# EAGLE design SUperUnioc_analog_ServosExtension (EAGLE 6.5.0)
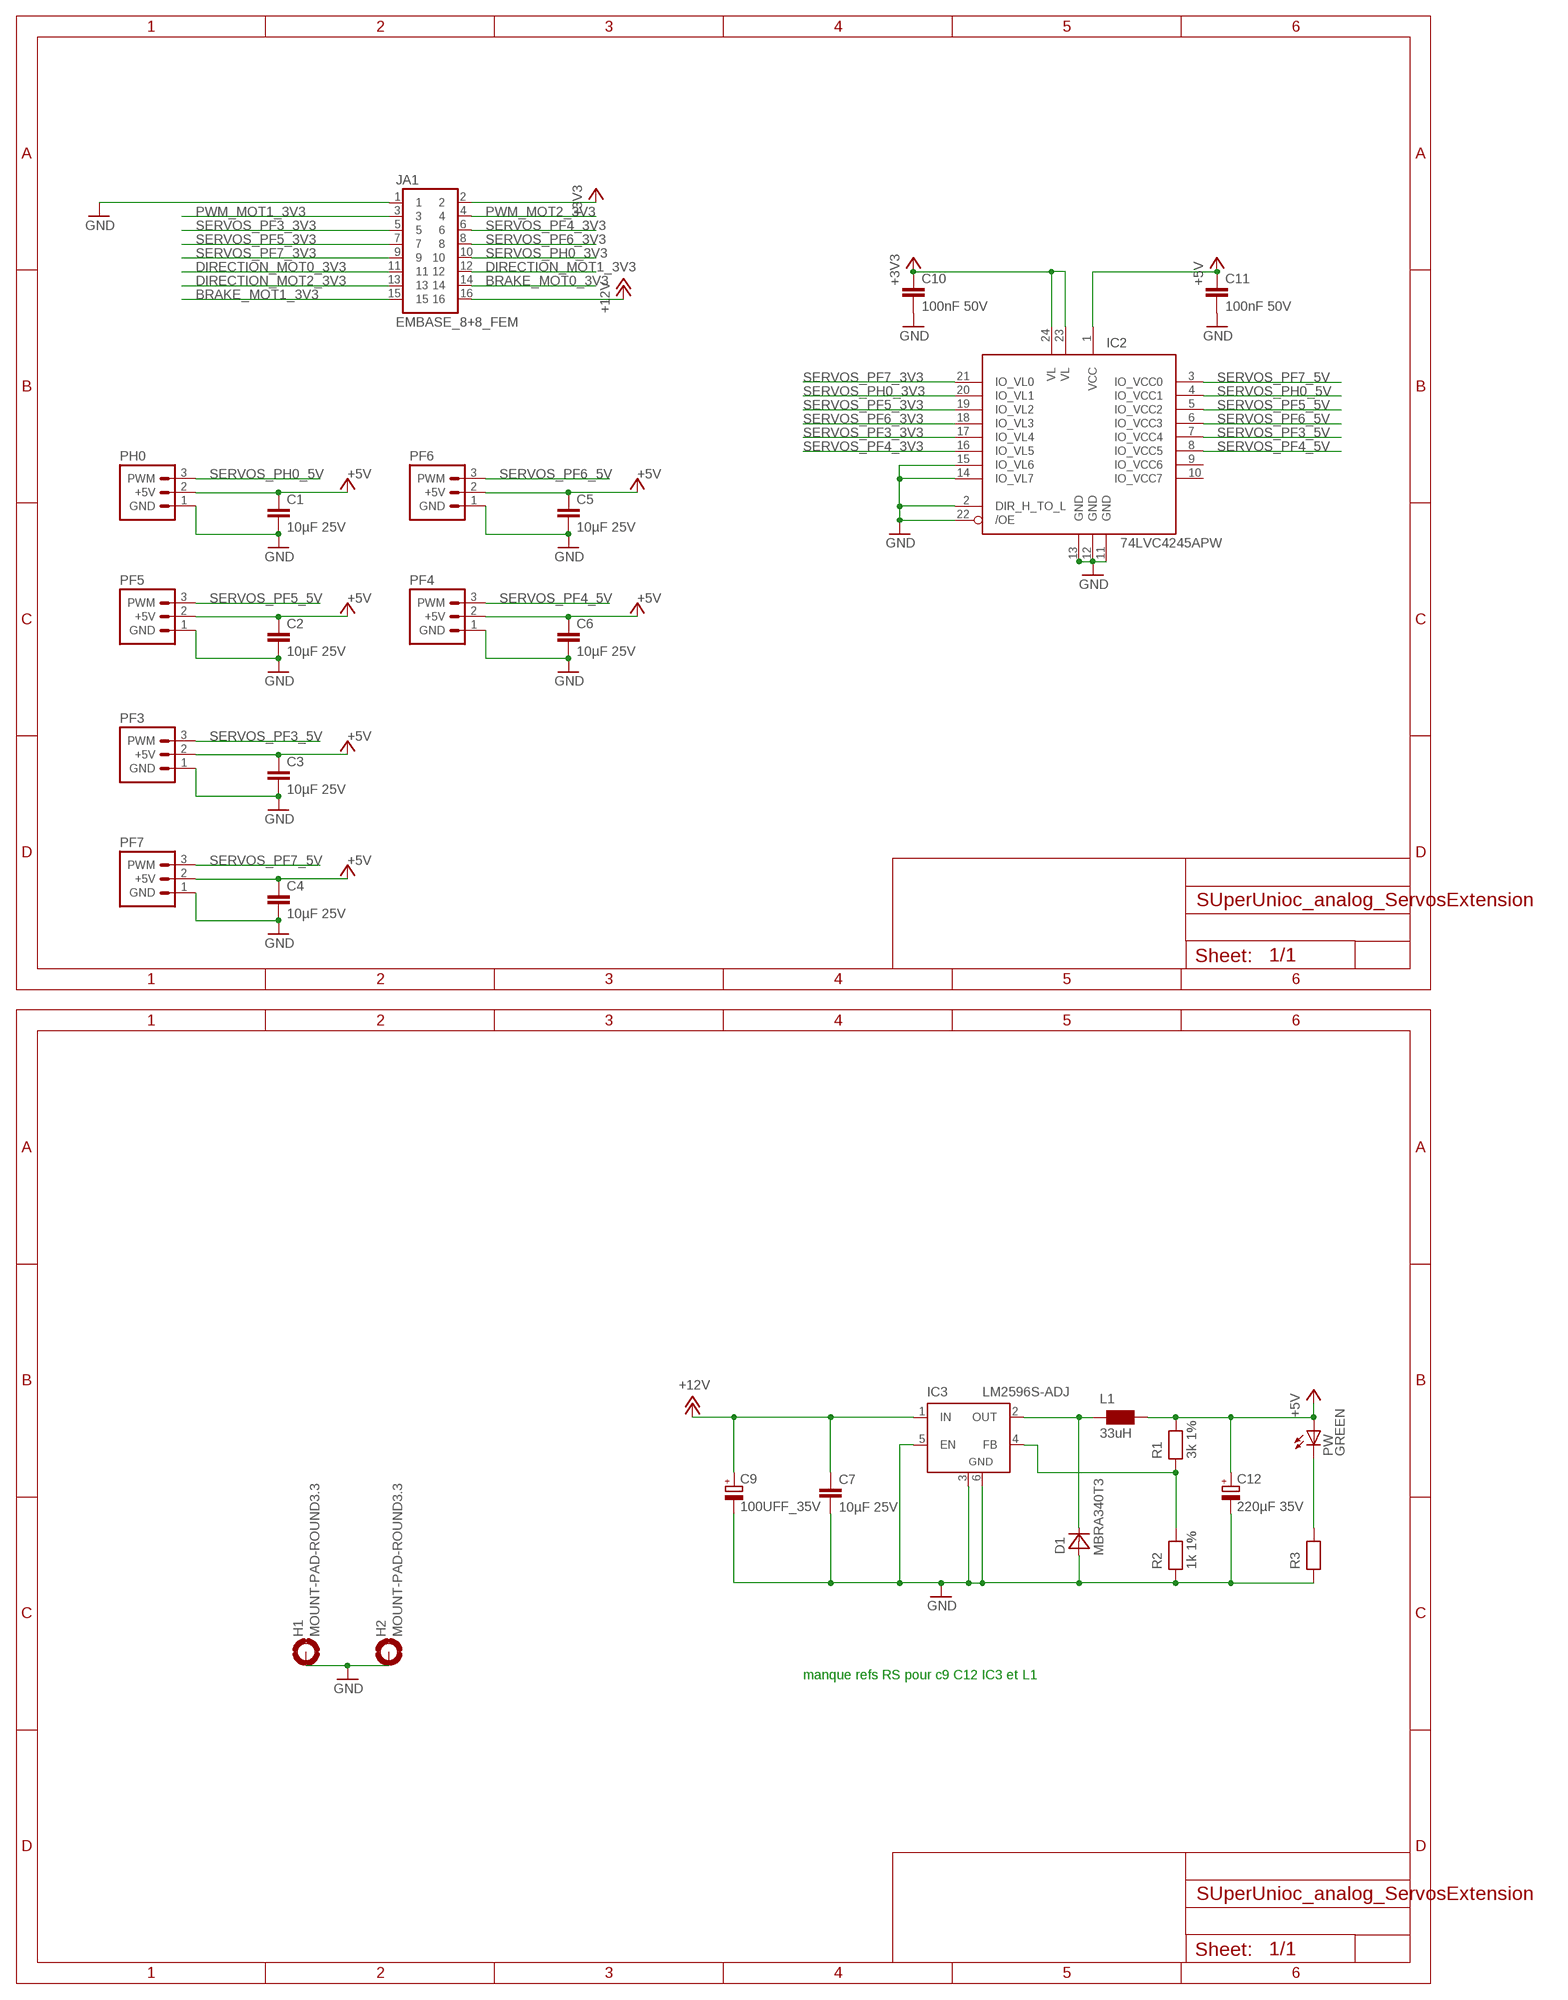
[diagram p0: schematic, sheet 1]

## Parts
C1  10µF 25V  10UF-C_25V  [C1210]
C2  10µF 25V  10UF-C_25V  [C1210]
C3  10µF 25V  10UF-C_25V  [C1210]
C4  10µF 25V  10UF-C_25V  [C1210]
C5  10µF 25V  10UF-C_25V  [C1210]
C6  10µF 25V  10UF-C_25V  [C1210]
C7  10µF 25V  10UF-C_25V  [C1210]
C9  100UFF_35V  [PANASONIC_F]
C10  100nF 50V  100NF-F  [C0603]
C11  100nF 50V  100NF-F  [C0603]
C12  220µF 35V  220UFF_35V  [PANASONIC_F]
D1  MBRA340T3  [SMA]
H1  MOUNT-PAD-ROUND3.3  [3,3-PAD]
H2  MOUNT-PAD-ROUND3.3  [3,3-PAD]
IC2  74LVC4245APW  [TSSOP24]
IC3  LM2596S-ADJ  [TO263-5]
JA1  EMBASE_8+8_FEM  [EMBASE_8+8_FEM]
L1  33uH  33µH-3.3A  [SRR1280]
PF3  ANALOG_SERVO  [ANALOG_SERVOS]
PF4  ANALOG_SERVO  [ANALOG_SERVOS]
PF5  ANALOG_SERVO  [ANALOG_SERVOS]
PF6  ANALOG_SERVO  [ANALOG_SERVOS]
PF7  ANALOG_SERVO  [ANALOG_SERVOS]
PH0  ANALOG_SERVO  [ANALOG_SERVOS]
PW  GREEN  LED_G  [CHIP-LED0805]
R1  3k 1%  3K09-F  [R0603]
R2  1k 1%  1K-F  [R0603]
R3  470-F  [R0603]

## Nets
+3V3: C10.1 IC2.23(VL) IC2.24(VL) JA1.2
+5V: C1.1 C2.1 C3.1 C4.1 C5.1 C6.1 C11.1 C12.+ IC2.1(VCC) L1.2 PF3.2(+5V) PF4.2(+5V) PF5.2(+5V) PF6.2(+5V) PF7.2(+5V) PH0.2(+5V) PW.A R1.2
+12V: C7.1 C9.+ IC3.1(IN) JA1.16
BRAKE_MOT0_3V3: JA1.14
BRAKE_MOT1_3V3: JA1.15
DIRECTION_MOT0_3V3: JA1.11
DIRECTION_MOT1_3V3: JA1.12
DIRECTION_MOT2_3V3: JA1.13
GND: C1.2 C2.2 C3.2 C4.2 C5.2 C6.2 C7.2 C9.- C10.2 C11.2 C12.- D1.A H1.B3,3(MOUNT) H2.B3,3(MOUNT) IC2.2(DIR_H_TO_L) IC2.11(GND) IC2.12(GND) IC2.13(GND) IC2.14(IO_VL7) IC2.15(IO_VL6) IC2.22(/OE) IC3.3(GND) IC3.5(EN) IC3.6(GND) JA1.1 PF3.1(GND) PF4.1(GND) PF5.1(GND) PF6.1(GND) PF7.1(GND) PH0.1(GND) R2.1 R3.1
N$1: PW.C R3.2
N$3: IC3.4(FB) R1.1 R2.2
N$17: D1.C IC3.2(OUT) L1.1
PWM_MOT1_3V3: JA1.3
PWM_MOT2_3V3: JA1.4
SERVOS_PF3_3V3: IC2.17(IO_VL4) JA1.5
SERVOS_PF3_5V: IC2.7(IO_VCC4) PF3.3(PWM)
SERVOS_PF4_3V3: IC2.16(IO_VL5) JA1.6
SERVOS_PF4_5V: IC2.8(IO_VCC5) PF4.3(PWM)
SERVOS_PF5_3V3: IC2.19(IO_VL2) JA1.7
SERVOS_PF5_5V: IC2.5(IO_VCC2) PF5.3(PWM)
SERVOS_PF6_3V3: IC2.18(IO_VL3) JA1.8
SERVOS_PF6_5V: IC2.6(IO_VCC3) PF6.3(PWM)
SERVOS_PF7_3V3: IC2.21(IO_VL0) JA1.9
SERVOS_PF7_5V: IC2.3(IO_VCC0) PF7.3(PWM)
SERVOS_PH0_3V3: IC2.20(IO_VL1) JA1.10
SERVOS_PH0_5V: IC2.4(IO_VCC1) PH0.3(PWM)
Unconnected: IC2.9(IO_VCC6) IC2.10(IO_VCC7)

## Notes on the sheet
- manque refs RS pour c9 C12 IC3 et L1

## Library data of the parts
C1-C7 = robotter_capacitor:10UF; MOUSER: 963-TMK316BJ106KL-T; RS: 766-1185
C9 = robotter_capacitor:100UF; MOUSER: 667-EEE-FK1V101P; RS: 537-0613; VALUE: 100µF 35V
C10 C11 = robotter_capacitor:100NF; MOUSER: 81-GRM188F51H104ZA01; RS: 723-5534
C12 = robotter_capacitor:220UF; MOUSER: 667-EEE-FP1V221AP; RS: 568-828
D1 = robotter_diode:MBRA340T3: Surface Mount Schottky Power Rectifier Source: http://www.onsemi.com/pub_link/Collateral/MBRA340T3-D.PDF; MOUSER: 863-MBRA340T3G; RS: 688-0502
H1 H2 = holes:MOUNT-PAD-ROUND: MOUNTING PAD, round
IC2 = robotter_ic:74LVC4245: octal transceiver buffer; MOUSER: 771-74LVC4245APW-T; RS: 380-0500
IC3 = robotter_ic:LM2596S: STEP-DOWN VOLTAGE REGULATOR; FARNELL: 1469194; MOUSER: 926-LM2596SX-ADJNOPB; RS: 533-3715
JA1 = robotter_connector:EMBASE_8+8_FEM; FARNELL: 1109794; MOUSER: 855-M22-7140842; RS: 605-8847
L1 = robotter_inductor:33µH; MOUSER: 652-SRR1280-330M; RS: 727-2274; VALUE: 33µH
PF3-PF7 PH0 = robotter_connector:ANALOG_SERVO: PIN HEADER; OC_FARNELL: unknown; OC_NEWARK: unknown
PW = robotter_diode:LED_; MOUSER: 859-LTST-C171GKT; RS: 692-0935
R1 = robotter_resistor:3K09; MOUSER: 667-ERA-3AEB3091V; RS: 708-7574
R2 = robotter_resistor:1K; MOUSER: 71-CRCW0603-1.0K-E3; RS: 213-2266; VALUE: 1k
R3 = robotter_resistor:470; MOUSER: 279-CRG0603F470R; RS: 213-2222

## Board
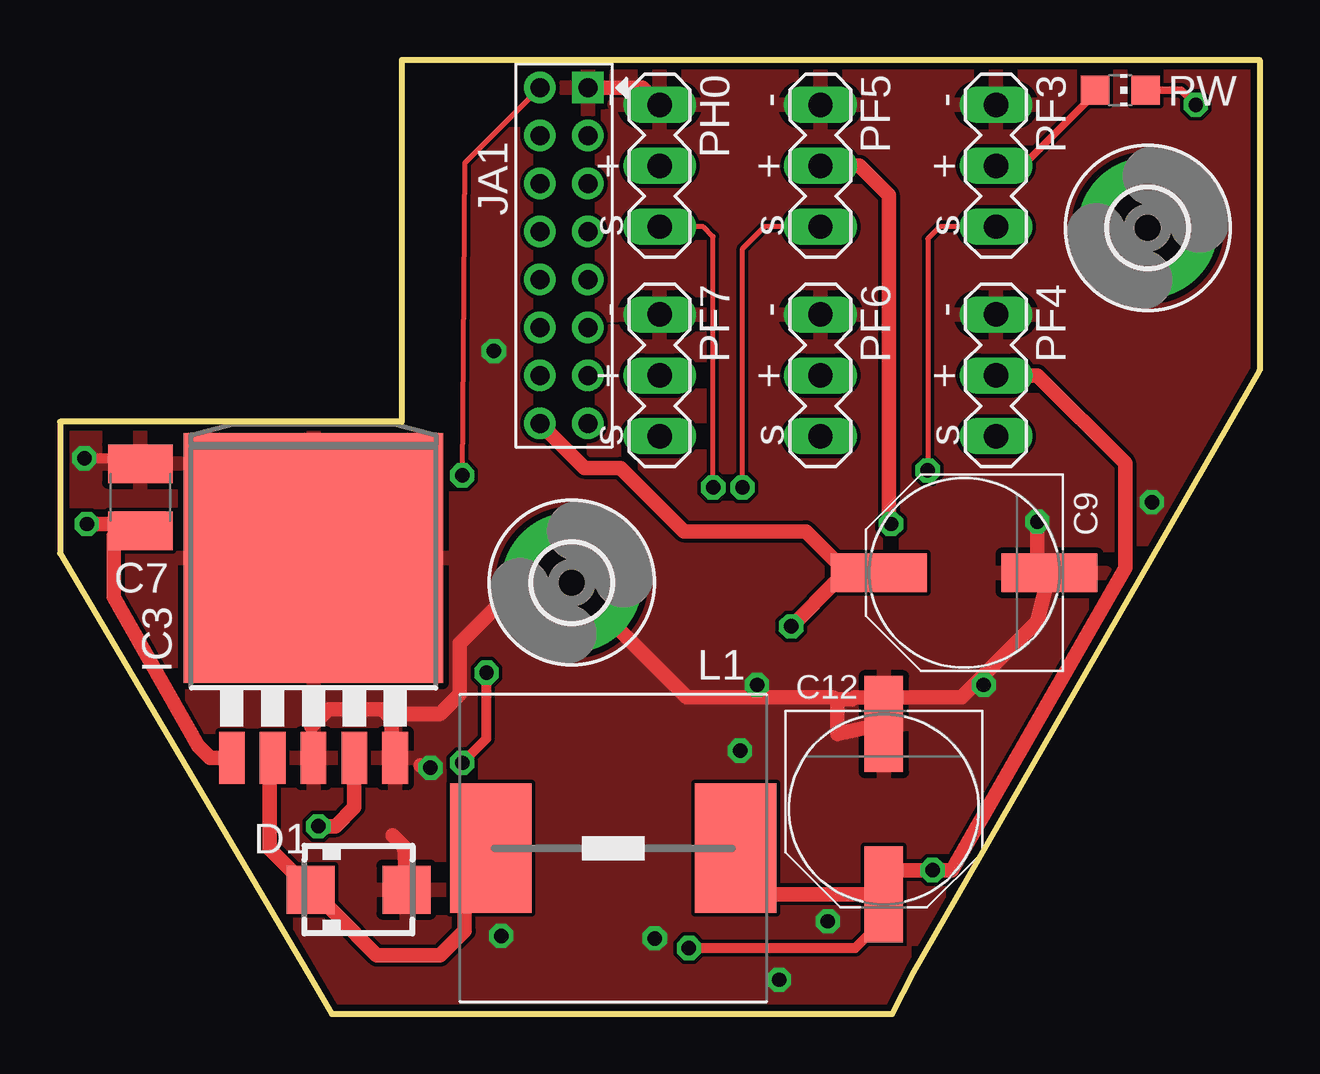
[diagram p1: board, top side]
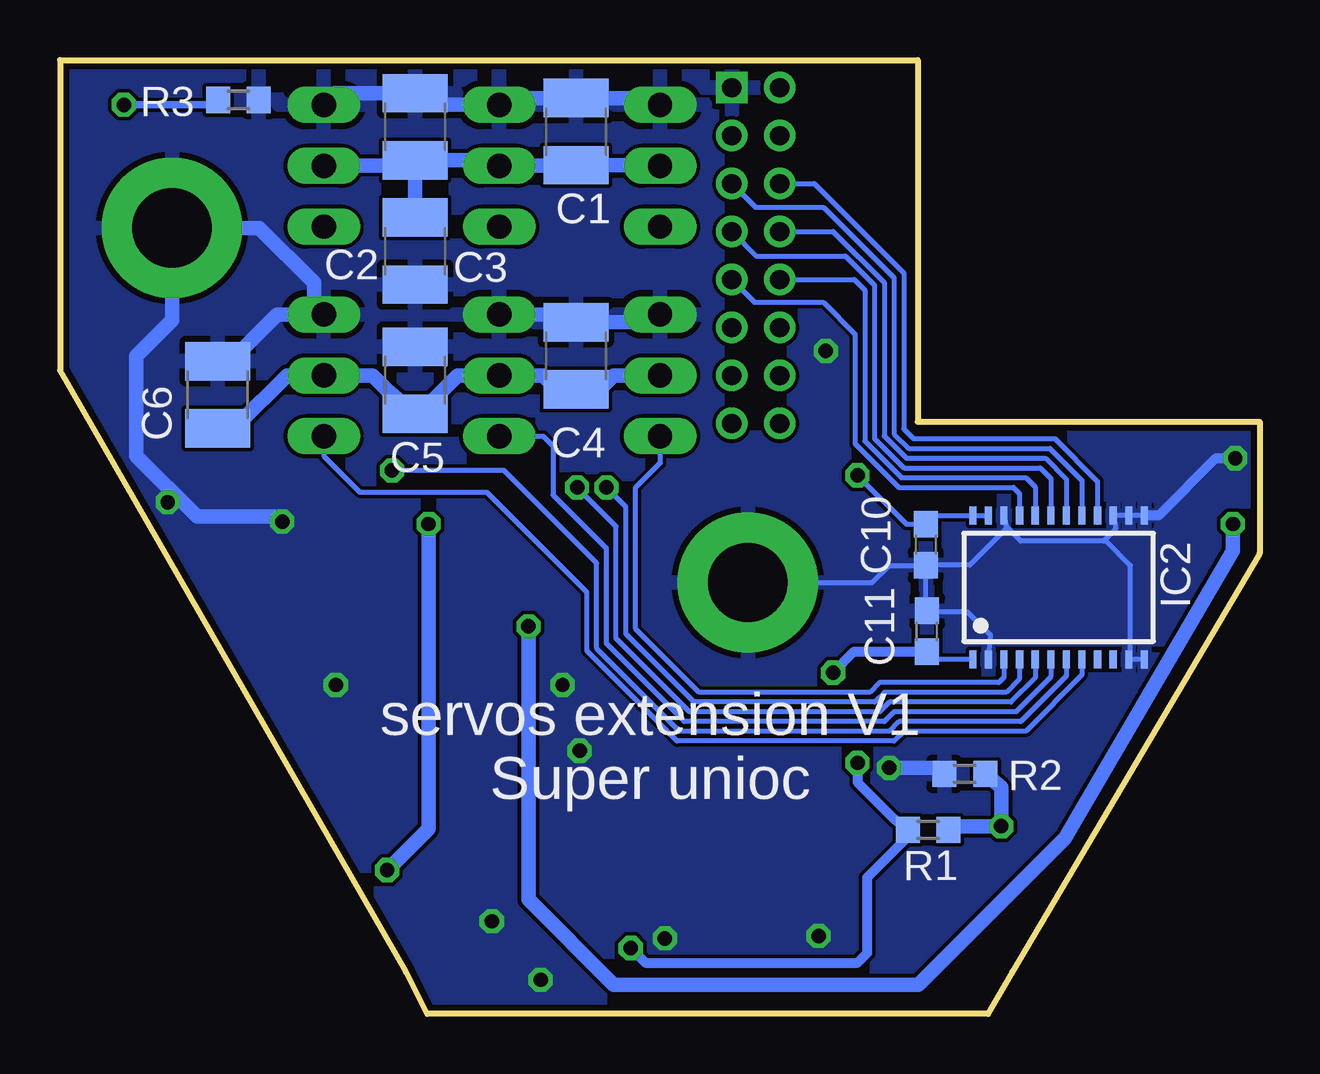
[diagram p2: board, bottom side, seen from below]

Size 50.01 x 39.77 mm. Coordinates in mm from the lower left corner, seen from the top.
Outline: 0.01,19.2 0.01,24.69 14.25,24.69 14.25,39.77 50.01,39.77 50.01,26.82 35.59,1.75 34.7,0 11.33,0 10.31,1.75 0,19.2
Copper layers (1*16): Top 0.035mm / dielectric 1.5mm / Bottom 0.035mm
Design rules "default *": minimum track width 6mil, minimum drill 6mil, track to track 6mil, track to pad 6mil, pad to pad 6mil, via to via 6mil, smd to smd 6mil, copper to edge 10mil, drill to drill 8mil, minimum pad ring 10mil, minimum via ring 8mil, stop-mask expansion 4mil, vias tented up to drill 0mil, thermal gap 10mil

### Footprints (pad centres in the part's own frame; a part is rotated, then mirrored left to right if it is on the bottom)
C1210 = smd 1.6 x 2.7: 1 -1.4,0; 2 1.4,0
PANASONIC_F = smd 4 x 1.6: + 3.55,0; - -3.55,0
C0603 = smd 1.1 x 1: 1 -0.85,0; 2 0.85,0
SMA = smd 2 x 2: A 2,0; C -2,0
3,3-PAD = drill 3.3 pad 5.842: B3,3 0,0
TSSOP24 = smd 0.3 x 0.75: 1 -3.575,-3; 2 -2.925,-3; 3 -2.275,-3; 4 -1.625,-3; 5 -0.975,-3; 6 -0.325,-3; 7 0.325,-3; 8 0.975,-3; 9 1.625,-3; 10 2.275,-3; 11 2.925,-3; 12 3.575,-3; 13 3.575,3; 14 2.925,3; 15 2.275,3; 16 1.625,3; 17 0.975,3; 18 0.325,3; 19 -0.325,3; 20 -0.975,3; 21 -1.625,3; 22 -2.275,3; 23 -2.925,3; 24 -3.575,3
TO263-5 = smd 1.067 x 2.159: 1 -3.404,-5.791; 2 -1.702,-5.791; 3 0,-5.791; 4 1.702,-5.791; 5 3.404,-5.791 | smd 10.8 x 10.41: 6 0,2.54
EMBASE_8+8_FEM = drill 0.8 pad 1.27 square: 1 -7,1 | drill 0.8 pad 1.27: 2 -7,-1; 3 -5,1; 4 -5,-1; 5 -3,1; 6 -3,-1; 7 -1,1; 8 -1,-1; 9 1,1; 10 1,-1; 11 3,1; 12 3,-1; 13 5,1; 14 5,-1; 15 7,1; 16 7,-1
SRR1280 = smd 3.4 x 5.4: 1 -5.1,0; 2 5.1,0
ANALOG_SERVOS = drill 1.016 long: 1 -2.54,0; 2 0,0; 3 2.54,0
CHIP-LED0805 = smd 1.2 x 1.2: A 0,-1.05; C 0,1.05
R0603 = smd 1 x 1.1: 1 -0.85,0; 2 0.85,0

### Placement (x,y rotation side)
C1  28.5,36.78 90 bottom
C2  35.2,36.98 90 bottom
C3  35.2,31.8 270 bottom
C4  28.5,27.43 90 bottom
C5  35.2,26.42 90 bottom
C6  43.43,25.81 90 bottom
C7  3.35,21.54 90 top
C9  37.69,18.39 180 top
C10  13.92,19.56 270 bottom
C11  13.87,15.95 90 bottom
C12  34.34,8.53 270 top
D1  12.45,5.18 0 top
H1  45.34,32.77 0 top
H2  21.34,17.98 0 top
IC2  8.38,17.78 0 bottom
IC3  10.57,16.46 0 top
JA1  21.01,31.61 270 top
L1  23.06,6.91 0 top
PF3  39.01,35.36 270 top
PF4  39.01,26.62 270 top
PF5  31.7,35.36 270 top
PF6  31.7,26.62 270 top
PF7  24.99,26.62 270 top
PH0  24.99,35.36 270 top
PW  44.2,38.51 270 top
R1  13.82,7.67 180 bottom
R2  12.29,10.01 0 bottom
R3  42.57,38.1 180 bottom

### Tracks (layer width: path | path; a pad name or v marks a point on that pad's centre or on a via)
+3V3  (via drill 0.6)
  Top 0.203: JA1.2 16.87,35.47 v16.76,22.45
  Bottom 0.203: v16.76,22.45 14.73,20.42 14.43,20.42 | 14.43,20.42 14.33,20.42 | IC2.23 IC2.24 13.55,20.78 C10.1 14.41,20.41 14.43,20.42
+5V  (via drill 0.6)
  Top 0.305: PW.A 43.15,38.37 40.13,35.36 PF3.2
  Top 0.406: v16.76,10.46 17.78,11.48 v17.78,14.22 | 34.46,5.99 34.34,4.47 34.34,3.95 33.14,2.74 v26.21,2.74
  Top 0.61: PF5.2 33.32,35.36 34.54,34.14 34.54,20.52 v34.65,20.42 | PF4.2 40.74,26.62 44.4,22.96 44.4,18.59 37.19,5.99 v36.37,5.99 34.46,5.99 C12.+ 28.95,4.98 28.24,5.69 28.24,6.83 L1.2
  Bottom 0.203: IC2.1 13.55,14.78 C11.1
  Bottom 0.406: v17.78,14.22 16.9,15.1 C11.1 | v26.21,2.74 25.6,2.13 16.76,2.13 16.36,2.54 16.36,5.69 14.68,7.37 R1.2 15.22,8.13 15.24,8.13 16.76,9.65 v16.76,10.46
  Bottom 0.61: PH0.2 25.02,35.38 C1.1 28.52,35.36 PF5.2 31.92,35.58 C2.1 | C2.1 35.43,35.36 PF3.2 | PF7.2 26.92,26.62 27.51,26.03 C4.1 28.68,26.21 29.46,26.21 29.87,26.62 PF6.2 33.43,26.62 35.03,25.02 C5.1 36.4,26.03 36.98,26.62 PF4.2 40.54,26.62 42.57,24.59 43.25,24.59 C6.1 | v34.65,20.42 34.65,7.72 v36.37,5.99 | C3.1 C2.1
+12V  (via drill 0.6)
  Top 0.61: JA1.16 21.86,22.76 23.37,22.76 26.01,20.12 31.09,20.12 32.72,18.49 | C9.+ 33.53,18.49 32.72,18.49 | 32.72,18.49 32.41,18.08 | 32.41,18.08 v30.48,16.15 | 32.72,18.49 32.51,18.49 32.41,18.08 | v1.12,20.42 2.16,20.42 C7.1 2.24,19.94 2.24,17.37 5.75,11.17 6.26,10.67 IC3.1
  Bottom 0.61: v1.12,20.42 1.12,19.3 8.13,7.32 14.22,1.22 26.92,1.22 30.48,4.78 v30.48,16.15
GND  (via drill 0.6)
  Top 0.406: v1.02,23.16 2.21,23.16 C7.2
  Top 0.61: 10.46,11.99 11.18,12.7 13.41,12.7 13.61,12.5 | 13.61,12.5 13.82,12.29 13.82,10.41 | JA1.1 24.28,38.61 PH0.1 | PF3.1 40.21,37.9 | 13.61,12.5 15.85,12.5 16.66,13.31 16.66,15.44 19.2,17.98 H2.B3,3 26.13,13.19 32.22,13.19 32.41,13 | 13.87,7.45 14.34,6.97 D1.A | v15.44,10.26 15.04,10.36 | v40.74,20.52 40.74,18.4 C9.- 40.74,16.35 37.57,13.19 33.1,13.19 33.02,13.11 32.51,13.11 32.41,13 | 32.41,13 32.41,11.68 C12.-
  Bottom 0.203: IC2.13 IC2.14 IC2.15 6.01,20.21 6.5,19.71 | 6.5,19.71 9.96,19.71 10.56,20.31 IC2.22 10.56,20.23 12.08,18.71 C10.2 | C10.2 13.92,16.85 C11.2 13.83,16.76 12.19,16.76 11.21,15.78 IC2.2 | IC2.12 IC2.11 5.38,14.81 5.38,18.69 6.4,19.71 6.5,19.71 | H2.B3,3 16.15,17.98 15.44,18.69 13.93,18.69 C10.2
  Bottom 0.406: v1.02,23.16 1.83,23.16 4.21,20.78 IC2.13
  Bottom 0.61: PH0.1 25.28,38.18 C1.2 31.42,38.18 PF5.1 34.72,37.9 C2.2 38.53,38.38 PF3.1 | PF7.1 25.32,28.83 C4.2 28.83,29.16 PF6.1 32.03,28.83 | C6.2 43.31,27.33 42.77,27.33 40.94,29.16 PF4.1 39.42,29.57 39.42,30.48 41.71,32.77 H1.B3,3 45.34,28.93 46.84,27.43 46.84,23.27 44.3,20.73 40.94,20.73 v40.74,20.52 | R2.1 13.5,10.26 v15.44,10.26
  other vias: 24.79,3.15 18.39,3.25 28.35,10.97 29.06,13.72 29.97,1.42 18.08,27.64 38.51,13.72 45.52,21.34 32,3.86
  pour Top: -3.05,41.05 58.62,41.05 58.62,20.93 58.62,-1.83 -1.52,-1.83 -3.05,-1.83
  pour Bottom: -4.47,43.28 58.01,43.28 58.01,12.09 58.01,-1.93 4.37,-1.93 -4.47,-1.93 -4.47,42.98
N$1  (via drill 0.6)
  Top 0.305: PW.C 46.74,38.51 v47.35,37.9
  Bottom 0.305: v47.35,37.9 43.62,37.9 R3.2
N$3  (via drill 0.6)
  Top 0.61: v10.77,7.82 11.48,7.82 12.27,8.61 IC3.4
  Bottom 0.61: R1.1 12.72,7.82 v10.77,7.82 10.77,9.43 R2.2
N$17
  Top 0.61: IC3.2 8.74,10.54 8.74,6.89 D1.C 11.46,4.18 13.21,2.44 15.85,2.44 16.87,3.45 16.87,4.78 17.96,5.87 L1.1
SERVOS_PF3_3V3
  Bottom 0.203: JA1.5 21.02,33.63 18.19,33.63 15.24,30.68 15.24,24.18 14.63,23.57 8.74,23.57 7.41,22.24 IC2.17
SERVOS_PF3_5V  (via drill 0.6)
  Top 0.203: PF3.3 36.68,32.82 36.17,32.31 v36.17,22.66
  Bottom 0.203: IC2.7 8.06,14.09 9.96,12.19 15.04,12.19 15.44,11.79 24.18,11.79 27.64,15.24 27.64,18.8 31.5,22.66 v36.17,22.66
SERVOS_PF4_3V3
  Bottom 0.203: JA1.6 18.56,34.61 14.83,30.89 14.83,24.38 14.43,23.98 8.53,23.98 6.76,22.2 IC2.16
SERVOS_PF4_5V
  Bottom 0.203: IC2.8 7.41,14.13 9.75,11.79 14.83,11.79 15.24,11.38 24.28,11.38 28.04,15.14 28.04,17.58 32.21,21.74 37.49,21.74 39.01,23.27 PF4.3
SERVOS_PF5_3V3
  Bottom 0.203: JA1.7 20.99,31.6 17.27,31.6 16.05,30.38 16.05,23.98 14.83,22.76 9.14,22.76 8.71,22.32 IC2.19
SERVOS_PF5_5V  (via drill 0.6)
  Top 0.203: v28.45,21.95 28.45,31.9 29.36,32.82 PF5.3
  Bottom 0.203: IC2.5 9.36,14.01 10.36,13 15.44,13 15.85,12.6 23.77,12.6 26.82,15.65 26.82,20.32 v28.45,21.95
SERVOS_PF6_3V3
  Bottom 0.203: JA1.8 17.78,32.61 15.65,30.48 15.65,24.08 14.73,23.16 8.94,23.16 8.06,22.28 IC2.18
SERVOS_PF6_5V
  Bottom 0.203: IC2.6 8.71,14.05 10.16,12.6 15.24,12.6 15.65,12.19 23.98,12.19 27.23,15.44 27.23,19.41 29.46,21.64 29.46,23.67 29.87,24.08 PF6.3
SERVOS_PF7_3V3
  Bottom 0.203: JA1.9 21.06,29.67 18.19,29.67 16.87,28.35 16.87,23.77 15.04,21.95 10.26,21.95 10.01,21.69 IC2.21
SERVOS_PF7_5V
  Bottom 0.203: IC2.3 10.66,14.03 10.87,13.82 15.85,13.82 16.26,13.41 23.37,13.41 26.01,16.05 26.01,21.95 24.99,22.96 PF7.3
SERVOS_PH0_3V3
  Bottom 0.203: JA1.10 16.9,30.61 16.46,30.18 16.46,23.88 14.94,22.35 9.75,22.35 9.36,21.96 IC2.20
SERVOS_PH0_5V  (via drill 0.6)
  Top 0.203: v27.23,21.95 27.23,32.41 26.82,32.82 PH0.3
  Bottom 0.203: IC2.4 10.01,13.97 10.57,13.41 15.65,13.41 16.05,13 23.57,13 26.42,15.85 26.42,21.13 v27.23,21.95

### Text on the board
bNames: servos extension V1 / Super unioc